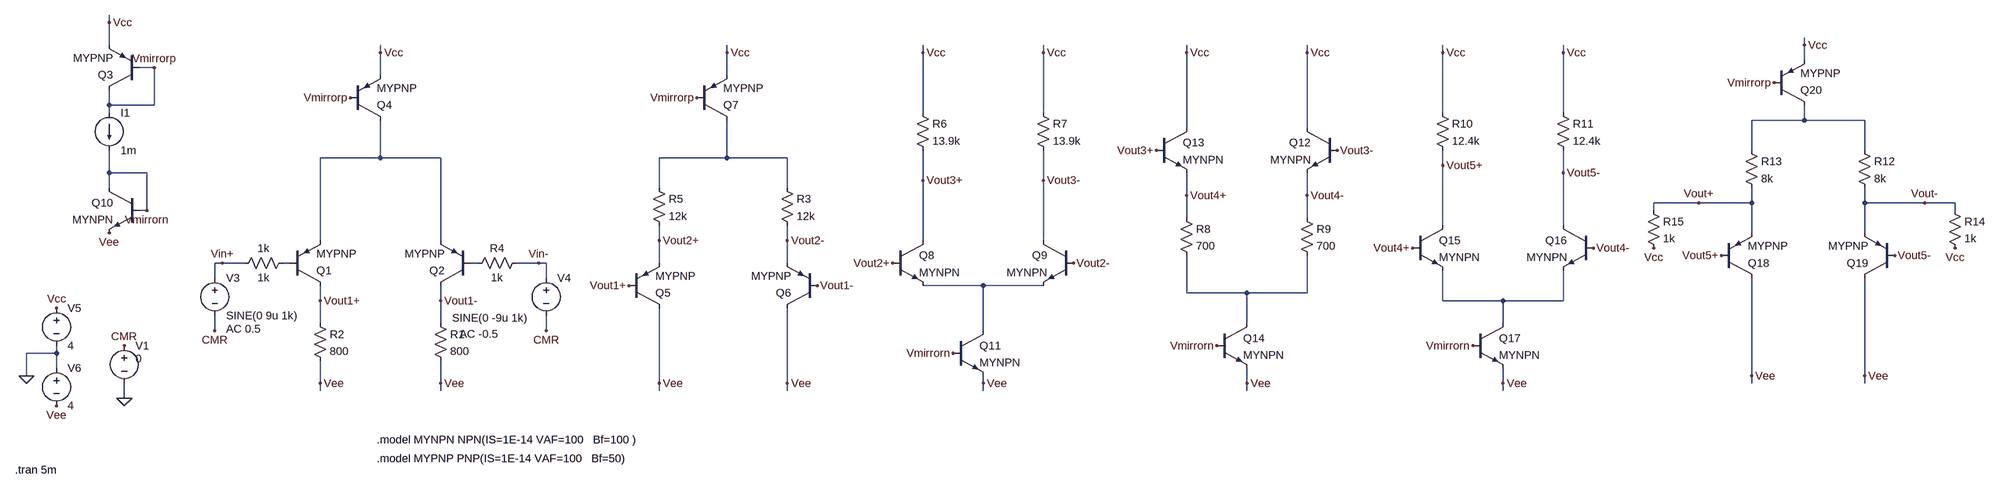
[diagram p0: schematic Draft1.asc]
Draft1.asc, the LTspice schematic file:
Version 4
SHEET 1 5428 840
WIRE -288 -400 -288 -416
WIRE -288 -352 -288 -400
WIRE 3312 -352 3312 -368
WIRE 288 -336 288 -352
WIRE 1024 -336 1024 -352
WIRE 1440 -336 1440 -352
WIRE 1696 -336 1696 -352
WIRE 2000 -336 2000 -352
WIRE 2256 -336 2256 -352
WIRE 2544 -336 2544 -352
WIRE 2800 -336 2800 -352
WIRE 3312 -320 3312 -352
WIRE -192 -304 -224 -304
WIRE 288 -288 288 -336
WIRE 1024 -288 1024 -336
WIRE -288 -224 -288 -256
WIRE -192 -224 -192 -304
WIRE -192 -224 -288 -224
WIRE -288 -208 -288 -224
WIRE 1440 -208 1440 -336
WIRE 1696 -208 1696 -336
WIRE 2544 -208 2544 -336
WIRE 2800 -208 2800 -336
WIRE 3312 -192 3312 -224
WIRE 3312 -192 3200 -192
WIRE 3440 -192 3312 -192
WIRE 2000 -176 2000 -336
WIRE 2256 -176 2256 -336
WIRE 3200 -128 3200 -192
WIRE 3440 -128 3440 -192
WIRE 288 -112 288 -192
WIRE 288 -112 160 -112
WIRE 416 -112 288 -112
WIRE 1024 -112 1024 -192
WIRE 1024 -112 880 -112
WIRE 1152 -112 1024 -112
WIRE 2544 -96 2544 -128
WIRE -288 -80 -288 -128
WIRE -208 -80 -288 -80
WIRE 2800 -80 2800 -128
WIRE 1440 -64 1440 -128
WIRE 1696 -64 1696 -128
WIRE -288 -48 -288 -80
WIRE 880 -48 880 -112
WIRE 1152 -48 1152 -112
WIRE 2000 -32 2000 -80
WIRE 2256 -32 2256 -80
WIRE 3088 -16 2992 -16
WIRE 3200 -16 3200 -48
WIRE 3200 -16 3088 -16
WIRE 3440 -16 3440 -48
WIRE 3568 -16 3440 -16
WIRE 3632 -16 3568 -16
WIRE -208 0 -208 -80
WIRE -208 0 -224 0
WIRE 2992 0 2992 -16
WIRE 3632 0 3632 -16
WIRE 2000 16 2000 -32
WIRE 2256 16 2256 -32
WIRE 2544 32 2544 -96
WIRE 2800 32 2800 -80
WIRE 3200 48 3200 -16
WIRE 3440 48 3440 -16
WIRE 160 64 160 -112
WIRE 416 64 416 -112
WIRE 880 64 880 32
WIRE 1152 64 1152 32
WIRE 1440 64 1440 -64
WIRE 1696 64 1696 -64
WIRE -48 112 -64 112
WIRE 0 112 -48 112
WIRE 96 112 80 112
WIRE 496 112 480 112
WIRE 624 112 576 112
WIRE 640 112 624 112
WIRE 880 112 880 64
WIRE 1152 112 1152 64
WIRE -64 144 -64 112
WIRE 640 144 640 112
WIRE 1568 160 1440 160
WIRE 1696 160 1568 160
WIRE 2000 176 2000 96
WIRE 2128 176 2000 176
WIRE 2256 176 2256 96
WIRE 2256 176 2128 176
WIRE 160 192 160 160
WIRE 416 192 416 160
WIRE 2544 192 2544 128
WIRE 2672 192 2544 192
WIRE 2800 192 2800 128
WIRE 2800 192 2672 192
WIRE 160 240 160 192
WIRE 416 240 416 192
WIRE 2128 240 2128 176
WIRE 2672 240 2672 192
WIRE -64 256 -64 224
WIRE 640 256 640 224
WIRE 1568 256 1568 160
WIRE -400 304 -400 288
WIRE -400 304 -464 304
WIRE -400 336 -400 304
WIRE -464 352 -464 304
WIRE 3200 352 3200 144
WIRE 3440 352 3440 144
WIRE 160 368 160 320
WIRE 416 368 416 320
WIRE 880 368 880 208
WIRE 1152 368 1152 208
WIRE 1568 368 1568 352
WIRE 2128 368 2128 336
WIRE 2672 368 2672 336
WIRE 3200 368 3200 352
WIRE 3440 368 3440 352
WIRE 160 384 160 368
WIRE 416 384 416 368
WIRE 880 384 880 368
WIRE 1152 384 1152 368
WIRE 1568 384 1568 368
WIRE 2128 384 2128 368
WIRE 2672 384 2672 368
WIRE -256 400 -256 368
FLAG -464 352 0
FLAG -400 208 Vcc
FLAG -400 416 Vee
FLAG -288 -400 Vcc
FLAG 288 -336 Vcc
FLAG 416 368 Vee
FLAG 160 368 Vee
FLAG 816 160 Vout1+
FLAG 1216 160 Vout1-
FLAG 1024 -336 Vcc
FLAG 880 368 Vee
FLAG 1152 368 Vee
FLAG -256 400 0
FLAG -256 288 CMR
FLAG 640 256 CMR
FLAG -64 256 CMR
FLAG -192 -304 Vmirrorp
FLAG 224 -240 Vmirrorp
FLAG 960 -240 Vmirrorp
FLAG -288 48 Vee
FLAG 1504 304 Vmirrorn
FLAG -208 0 Vmirrorn
FLAG 1376 112 Vout2+
FLAG 1760 112 Vout2-
FLAG 160 192 Vout1+
FLAG 416 192 Vout1-
FLAG 880 64 Vout2+
FLAG 1152 64 Vout2-
FLAG 1440 -64 Vout3+
FLAG 1936 -128 Vout3+
FLAG 1696 -64 Vout3-
FLAG 2320 -128 Vout3-
FLAG 2800 -336 Vcc
FLAG 2608 288 Vmirrorn
FLAG 2480 80 Vout4+
FLAG 2864 80 Vout4-
FLAG 1440 -336 Vcc
FLAG 1696 -336 Vcc
FLAG 2544 -336 Vcc
FLAG 624 112 Vin-
FLAG 2800 -80 Vout5-
FLAG 2544 -96 Vout5+
FLAG 2000 -336 Vcc
FLAG 2256 -336 Vcc
FLAG 2064 288 Vmirrorn
FLAG 2256 -32 Vout4-
FLAG 2000 -32 Vout4+
FLAG 3136 96 Vout5+
FLAG 3504 96 Vout5-
FLAG 3312 -352 Vcc
FLAG 3200 352 Vee
FLAG 3440 352 Vee
FLAG 3248 -272 Vmirrorp
FLAG 3632 80 Vcc
FLAG 2992 80 Vcc
FLAG 1568 368 Vee
FLAG 2128 368 Vee
FLAG 2672 368 Vee
FLAG 3568 -16 Vout-
FLAG 3088 -16 Vout+
FLAG -48 112 Vin+
SYMBOL res 592 96 R90
WINDOW 0 0 56 VBottom 2
WINDOW 3 32 56 VTop 2
SYMATTR InstName R4
SYMATTR Value 1k
SYMBOL voltage -64 128 R0
WINDOW 123 24 124 Left 2
WINDOW 39 0 0 Left 0
SYMATTR Value2 AC 0.5
SYMATTR InstName V3
SYMATTR Value SINE(0 9u 1k)
SYMBOL res 96 96 R90
WINDOW 0 0 56 VBottom 2
WINDOW 3 32 56 VTop 2
SYMATTR InstName 1k
SYMATTR Value 1k
SYMBOL voltage 640 128 R0
WINDOW 123 -184 135 Left 2
WINDOW 39 0 0 Left 0
WINDOW 3 -200 101 Left 2
SYMATTR Value2 AC -0.5
SYMATTR Value SINE(0 -9u 1k)
SYMATTR InstName V4
SYMBOL voltage -400 192 R0
WINDOW 123 0 0 Left 0
WINDOW 39 0 0 Left 0
SYMATTR InstName V5
SYMATTR Value 4
SYMBOL voltage -400 320 R0
WINDOW 123 0 0 Left 0
WINDOW 39 0 0 Left 0
SYMATTR InstName V6
SYMATTR Value 4
SYMBOL pnp -224 -256 R180
SYMATTR InstName Q3
SYMATTR Value MYPNP
SYMBOL pnp 224 -192 M180
SYMATTR InstName Q4
SYMATTR Value MYPNP
SYMBOL current -288 -208 R0
WINDOW 123 0 0 Left 0
WINDOW 39 0 0 Left 0
SYMATTR InstName I1
SYMATTR Value 1m
SYMBOL pnp 96 160 M180
SYMATTR InstName Q1
SYMATTR Value MYPNP
SYMBOL pnp 480 160 R180
SYMATTR InstName Q2
SYMATTR Value MYPNP
SYMBOL pnp 816 208 M180
SYMATTR InstName Q5
SYMATTR Value MYPNP
SYMBOL pnp 1216 208 R180
SYMATTR InstName Q6
SYMATTR Value MYPNP
SYMBOL pnp 960 -192 M180
SYMATTR InstName Q7
SYMATTR Value MYPNP
SYMBOL voltage -256 272 R0
WINDOW 123 0 0 Left 0
WINDOW 39 0 0 Left 0
WINDOW 3 24 44 Left 2
SYMATTR Value 0
SYMATTR InstName V1
SYMBOL npn 1376 64 R0
SYMATTR InstName Q8
SYMATTR Value MYNPN
SYMBOL npn 1760 64 M0
SYMATTR InstName Q9
SYMATTR Value MYNPN
SYMBOL res 1424 -224 R0
SYMATTR InstName R6
SYMATTR Value 13.9k
SYMBOL res 1680 -224 R0
SYMATTR InstName R7
SYMATTR Value 13.9k
SYMBOL npn -224 -48 M0
SYMATTR InstName Q10
SYMATTR Value MYNPN
SYMBOL npn 1504 256 R0
SYMATTR InstName Q11
SYMATTR Value MYNPN
SYMBOL res 400 224 R0
SYMATTR InstName R1
SYMATTR Value 800
SYMBOL res 144 224 R0
SYMATTR InstName R2
SYMATTR Value 800
SYMBOL res 1136 -64 R0
SYMATTR InstName R3
SYMATTR Value 12k
SYMBOL res 864 -64 R0
SYMATTR InstName R5
SYMATTR Value 12k
SYMBOL res 2528 -224 R0
SYMATTR InstName R10
SYMATTR Value 12.4k
SYMBOL res 2784 -224 R0
SYMATTR InstName R11
SYMATTR Value 12.4k
SYMBOL npn 2480 32 R0
SYMATTR InstName Q15
SYMATTR Value MYNPN
SYMBOL npn 2864 32 M0
SYMATTR InstName Q16
SYMATTR Value MYNPN
SYMBOL npn 2608 240 R0
SYMATTR InstName Q17
SYMATTR Value MYNPN
SYMBOL npn 2320 -176 M0
SYMATTR InstName Q12
SYMATTR Value MYNPN
SYMBOL npn 1936 -176 R0
SYMATTR InstName Q13
SYMATTR Value MYNPN
SYMBOL res 1984 0 R0
SYMATTR InstName R8
SYMATTR Value 700
SYMBOL res 2240 0 R0
SYMATTR InstName R9
SYMATTR Value 700
SYMBOL npn 2064 240 R0
SYMATTR InstName Q14
SYMATTR Value MYNPN
SYMBOL pnp 3136 144 M180
SYMATTR InstName Q18
SYMATTR Value MYPNP
SYMBOL pnp 3504 144 R180
SYMATTR InstName Q19
SYMATTR Value MYPNP
SYMBOL pnp 3248 -224 M180
SYMATTR InstName Q20
SYMATTR Value MYPNP
SYMBOL res 3424 -144 R0
SYMATTR InstName R12
SYMATTR Value 8k
SYMBOL res 3184 -144 R0
SYMATTR InstName R13
SYMATTR Value 8k
SYMBOL res 3616 -16 R0
SYMATTR InstName R14
SYMATTR Value 1k
SYMBOL res 2976 -16 R0
SYMATTR InstName R15
SYMATTR Value 1k
TEXT 280 488 Left 2 !.model MYNPN NPN(IS=1E-14 VAF=100   Bf=100 )
TEXT 280 528 Left 2 !.model MYPNP PNP(IS=1E-14 VAF=100   Bf=50)
TEXT -488 552 Left 2 !.tran 5m

The netlist it stands for:
* Draft1.asc
R4 Vin- N005 1k
V3 Vin+ CMR SINE(0 9u 1k) AC 0.5
R§1k N004 Vin+ 1k
V4 Vin- CMR SINE(0 -9u 1k) AC -0.5
V5 Vcc 0 4
V6 0 Vee 4
Q3 Vmirrorp Vmirrorp Vcc 0 MYPNP
Q4 N002 Vmirrorp Vcc 0 MYPNP
I1 Vmirrorp Vmirrorn 1m
Q1 Vout1+ N004 N002 0 MYPNP
Q2 Vout1- N005 N002 0 MYPNP
Q5 Vee Vout1+ Vout2+ 0 MYPNP
Q6 Vee Vout1- Vout2- 0 MYPNP
Q7 N003 Vmirrorp Vcc 0 MYPNP
V1 CMR 0 0
Q8 Vout3+ Vout2+ N006 0 MYNPN
Q9 Vout3- Vout2- N006 0 MYNPN
R6 Vcc Vout3+ 13.9k
R7 Vcc Vout3- 13.9k
Q10 Vmirrorn Vmirrorn Vee 0 MYNPN
Q11 N006 Vmirrorn Vee 0 MYNPN
R1 Vout1- Vee 800
R2 Vout1+ Vee 800
R3 N003 Vout2- 12k
R5 N003 Vout2+ 12k
R10 Vcc Vout5+ 12.4k
R11 Vcc Vout5- 12.4k
Q15 Vout5+ Vout4+ N008 0 MYNPN
Q16 Vout5- Vout4- N008 0 MYNPN
Q17 N008 Vmirrorn Vee 0 MYNPN
Q12 Vcc Vout3- Vout4- 0 MYNPN
Q13 Vcc Vout3+ Vout4+ 0 MYNPN
R8 Vout4+ N007 700
R9 Vout4- N007 700
Q14 N007 Vmirrorn Vee 0 MYNPN
Q18 Vee Vout5+ Vout+ 0 MYPNP
Q19 Vee Vout5- Vout- 0 MYPNP
Q20 N001 Vmirrorp Vcc 0 MYPNP
R12 N001 Vout- 8k
R13 N001 Vout+ 8k
R14 Vout- Vcc 1k
R15 Vout+ Vcc 1k
.model NPN NPN
.model PNP PNP
.lib standard.bjt
.model MYNPN NPN(IS=1E-14 VAF=100   Bf=100 )
.model MYPNP PNP(IS=1E-14 VAF=100   Bf=50)
.tran 5m
.backanno
.end